# Altium schematic sheet sfp_phy_0.SchDoc: <SPECIFIC SHEET FUNCTION>
size A3; Date: DO NOT USE, RATHER USE PROJ OPTIONS; DrawnBy: DO NOT USE, RATHER USE PROJ OPTIONS; Engineer: DO NOT USE, RATHER USE PROJ OPTIONS; Organization: DO NOT USE, RATHER USE PROJ OPTIONS; DocumentNumber: DO NOT USE, RATHER USE PROJ OPTIONS; Revision: DO NOT USE, RATHER USE PROJ OPTIONS; SheetNumber: 1; SheetTotal: 1; SCH_Sheet_Filename: <Filename.SchDoc>; CurrentTime: DO NOT USE, RATHER USE PROJ OPTIONS; Time: DO NOT USE, RATHER USE PROJ OPTIONS; DocumentFullPathAndName: DO NOT USE, RATHER USE PROJ OPTIONS; DocumentName: DO NOT USE, RATHER USE PROJ OPTIONS; ModifiedDate: DO NOT USE, RATHER USE PROJ OPTIONS; ImagePath: DO NOT USE, RATHER USE PROJ OPTIONS
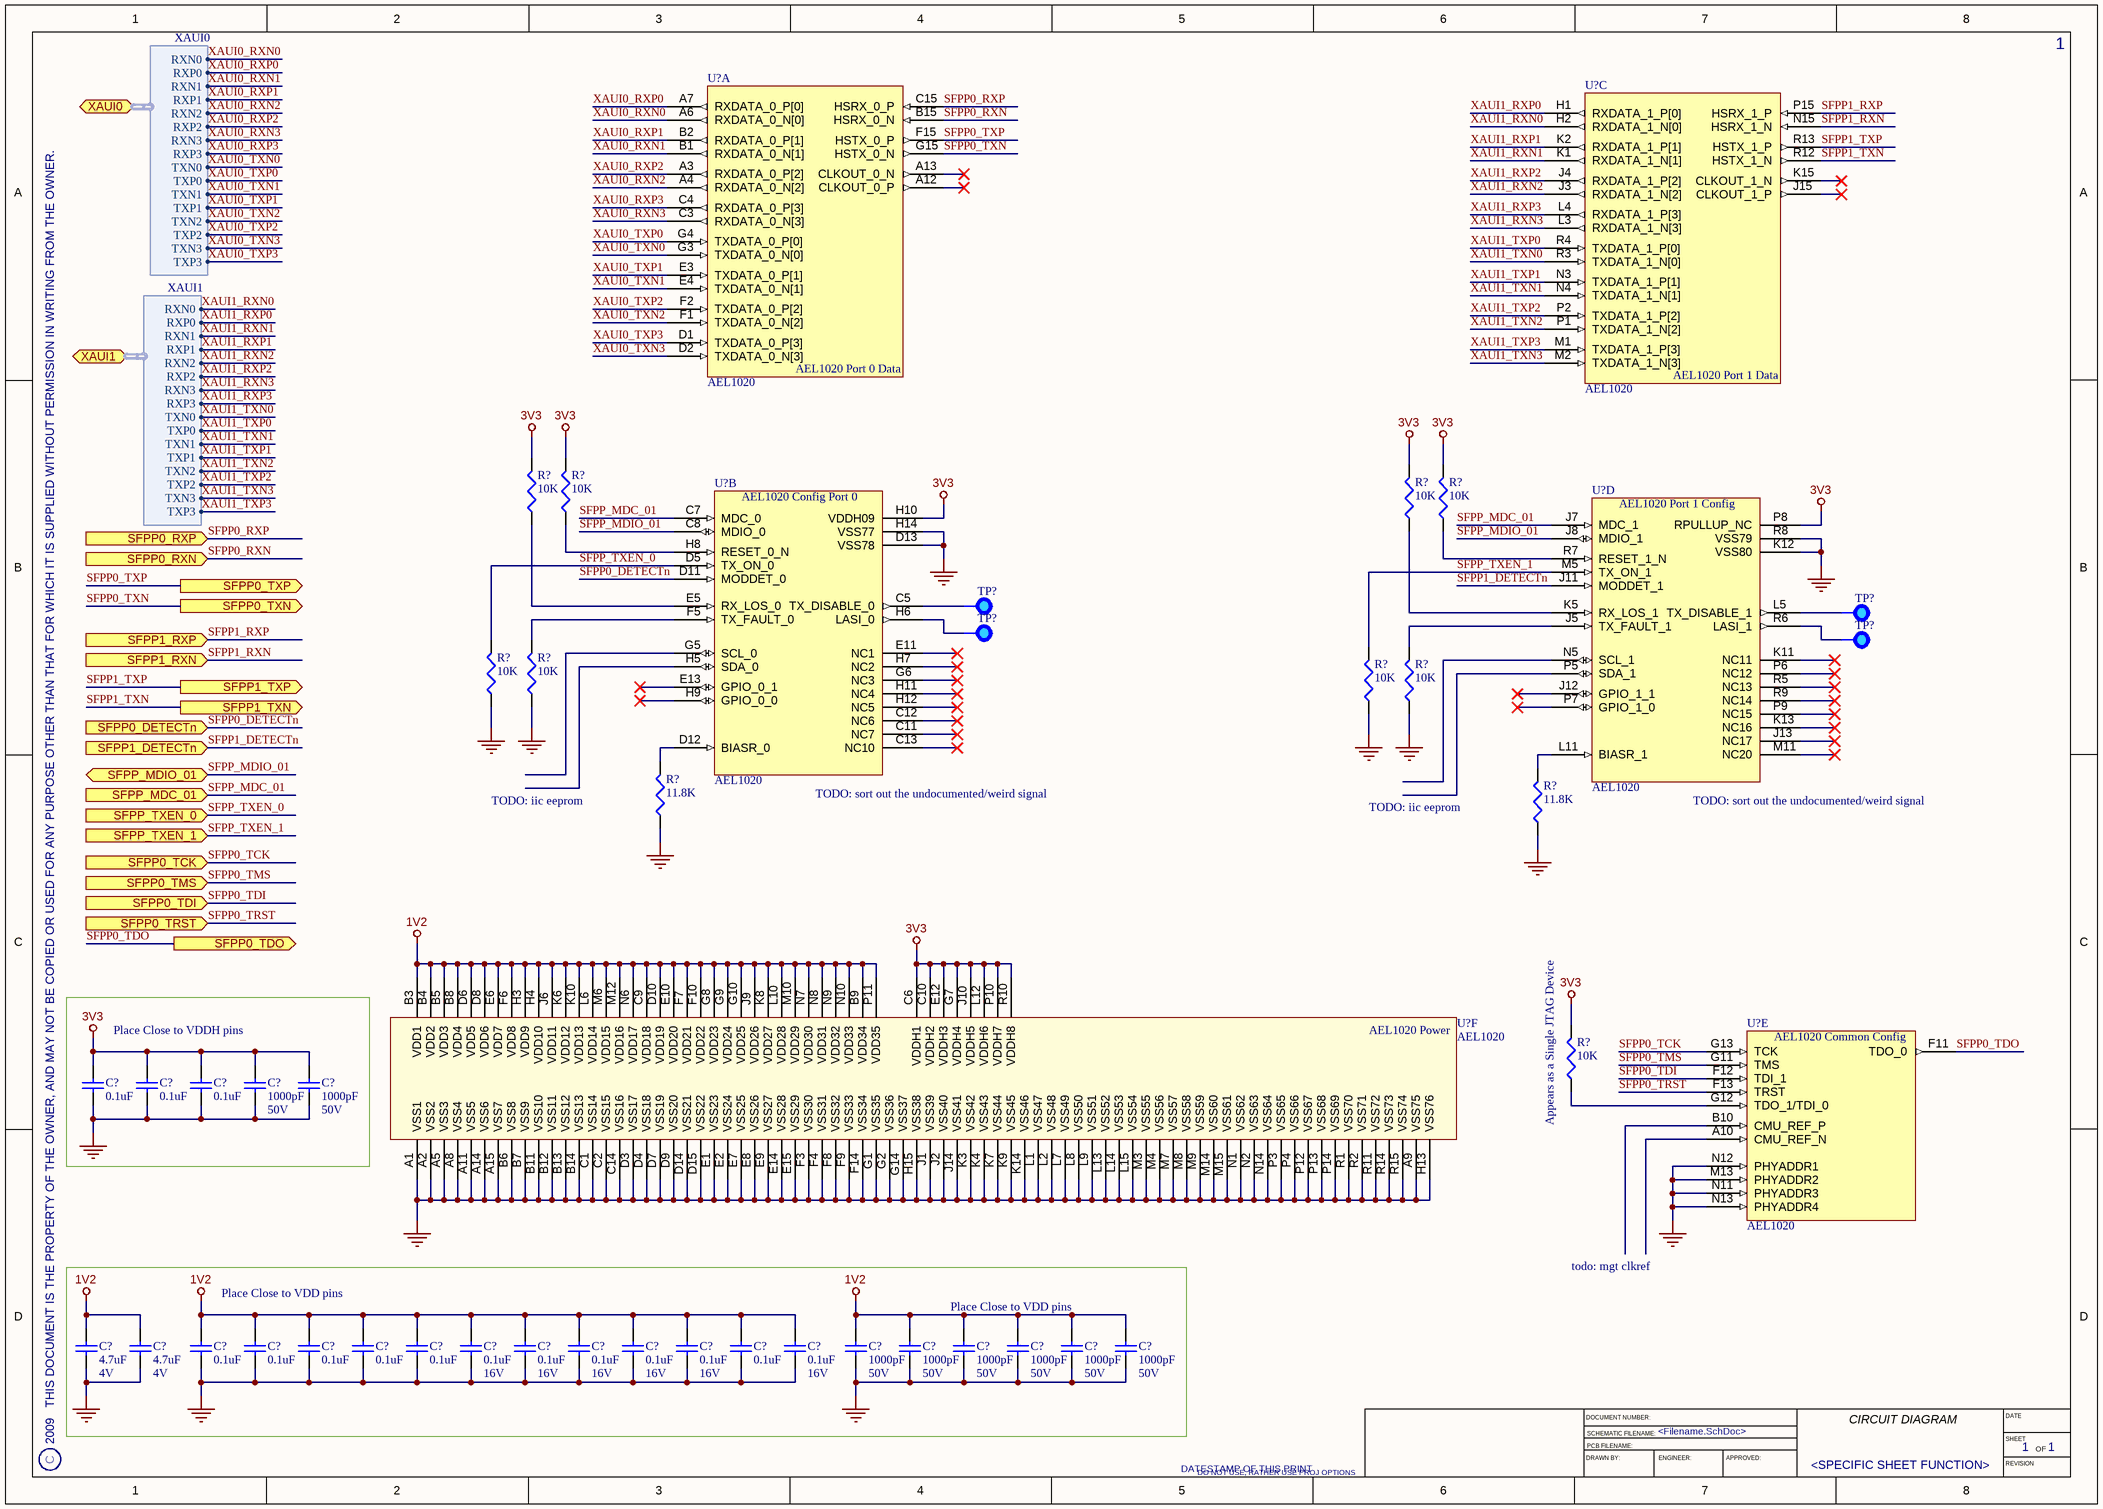
[diagram p0: sfp_phy_0.SchDoc]

## Parts
(Parts that share a designator on the sheet are numbered #1, #2 ... from top to bottom, then left to right.)
C?#1  value 0.1uF  [CAPC1005L]  (hidden comment: CapStd)
C?#2  value 0.1uF  [CAPC1005L]  (hidden comment: CapStd)
C?#3  value 0.1uF  [CAPC1005L]  (hidden comment: CapStd)
C?#4  value 1000pF  Rating: 50V  [CAPC1005L]  (hidden comment: CapStd)
C?#5  value 1000pF  Rating: 50V  [CAPC1005L]  (hidden comment: CapStd)
C?#6  value 4.7uF  Rating: 4V  [CAPC1005L]  (hidden comment: CapStd)
C?#7  value 4.7uF  Rating: 4V  [CAPC1005L]  (hidden comment: CapStd)
C?#8  value 0.1uF  [CAPC1005L]  (hidden comment: CapStd)
C?#9  value 0.1uF  [CAPC1005L]  (hidden comment: CapStd)
C?#10  value 0.1uF  [CAPC1005L]  (hidden comment: CapStd)
C?#11  value 0.1uF  [CAPC1005L]  (hidden comment: CapStd)
C?#12  value 0.1uF  [CAPC1005L]  (hidden comment: CapStd)
C?#13  value 0.1uF  Rating: 16V  [CAPC1005L]  (hidden comment: CapStd)
C?#14  value 0.1uF  Rating: 16V  [CAPC1005L]  (hidden comment: CapStd)
C?#15  value 0.1uF  Rating: 16V  [CAPC1005L]  (hidden comment: CapStd)
C?#16  value 0.1uF  Rating: 16V  [CAPC1005L]  (hidden comment: CapStd)
C?#17  value 0.1uF  Rating: 16V  [CAPC1005L]  (hidden comment: CapStd)
C?#18  value 0.1uF  [CAPC1005L]  (hidden comment: CapStd)
C?#19  value 0.1uF  Rating: 16V  [CAPC1005L]  (hidden comment: CapStd)
C?#20  value 1000pF  Rating: 50V  [CAPC1005L]  (hidden comment: CapStd)
C?#21  value 1000pF  Rating: 50V  [CAPC1005L]  (hidden comment: CapStd)
C?#22  value 1000pF  Rating: 50V  [CAPC1005L]  (hidden comment: CapStd)
C?#23  value 1000pF  Rating: 50V  [CAPC1005L]  (hidden comment: CapStd)
C?#24  value 1000pF  Rating: 50V  [CAPC1005L]  (hidden comment: CapStd)
C?#25  value 1000pF  Rating: 50V  [CAPC1005L]  (hidden comment: CapStd)
R?#1  value 10K  [RESC1005L]  (hidden comment: ResStd)
R?#2  value 10K  [RESC1005L]  (hidden comment: ResStd)
R?#3  value 10K  [RESC1005L]  (hidden comment: ResStd)
R?#4  value 10K  [RESC1005L]  (hidden comment: ResStd)
R?#5  value 10K  [RESC1005L]  (hidden comment: ResStd)
R?#6  value 10K  [RESC1005L]  (hidden comment: ResStd)
R?#7  value 10K  [RESC1005L]  (hidden comment: ResStd)
R?#8  value 10K  [RESC1005L]  (hidden comment: ResStd)
R?#9  value 11.8K  [RESC1608L]  (hidden comment: ResStd)
R?#10  value 11.8K  [RESC1608L]  (hidden comment: ResStd)
R?#11  value 10K  [RESC1005L]  (hidden comment: ResStd)
TP?#1  Testpoint  [TP-TBD]  (value not drawn)
TP?#2  Testpoint  [TP-TBD]  (value not drawn)
TP?#3  Testpoint  [TP-TBD]  (value not drawn)
TP?#4  Testpoint  [TP-TBD]  (value not drawn)
U?#1  AEL1020  [AEL1020]  (part A of 6)
U?#2  AEL1020  [AEL1020]  (part C of 6)
U?#3  AEL1020  [AEL1020]  (part B of 6)
U?#4  AEL1020  [AEL1020]  (part D of 6)
U?#5  AEL1020  [AEL1020]  (part F of 6)
U?#6  AEL1020  [AEL1020]  (part E of 6)

## Blocks framed on the sheet
Place Close to VDDH pins: C?#1-C?#5

## Ports
SFPP0_DETECTn (in), SFPP0_RXN (in), SFPP0_RXP (in), SFPP0_TCK (in), SFPP0_TDI (in), SFPP0_TDO (out), SFPP0_TMS (in), SFPP0_TRST (in), SFPP0_TXN (out), SFPP0_TXP (out), SFPP1_DETECTn (in), SFPP1_RXN (in), SFPP1_RXP (in), SFPP1_TXN (out), SFPP1_TXP (out), SFPP_MDC_01 (in), SFPP_MDIO_01 (bidir), SFPP_TXEN_0 (in), SFPP_TXEN_1 (in), XAUI0 (harness XAUI0), XAUI1 (harness XAUI1)

## Harnesses
XAUI0: RXN0, RXP0, RXN1, RXP1, RXN2, RXP2, RXN3, RXP3, TXN0, TXP0, TXN1, TXP1, TXN2, TXP2, TXN3, TXP3
XAUI1: RXN0, RXP0, RXN1, RXP1, RXN2, RXP2, RXN3, RXP3, TXN0, TXP0, TXN1, TXP1, TXN2, TXP2, TXN3, TXP3

## Nets
1V2: C?#6.2 C?#7.2 C?#8.2 C?#9.2 C?#10.2 C?#11.2 C?#12.2 C?#13.2 C?#14.2 C?#15.2 C?#16.2 C?#17.2 C?#18.2 C?#19.2 C?#20.2 C?#21.2 C?#22.2 C?#23.2 C?#24.2 C?#25.2 U?#5.B3(VDD1) U?#5.B4(VDD2) U?#5.B5(VDD3) U?#5.B8(VDD4) U?#5.B9(VDD34) U?#5.C9(VDD18) U?#5.D6(VDD5) U?#5.D8(VDD6) U?#5.D10(VDD19) U?#5.E6(VDD7) U?#5.E10(VDD20) U?#5.F6(VDD8) U?#5.F7(VDD21) U?#5.F10(VDD22) U?#5.G8(VDD23) U?#5.G9(VDD24) U?#5.G10(VDD25) U?#5.H3(VDD9) U?#5.H4(VDD10) U?#5.J6(VDD11) U?#5.J9(VDD26) U?#5.K6(VDD12) U?#5.K8(VDD27) U?#5.K10(VDD13) U?#5.L6(VDD14) U?#5.L10(VDD28) U?#5.M6(VDD15) U?#5.M10(VDD29) U?#5.M12(VDD16) U?#5.N6(VDD17) U?#5.N7(VDD30) U?#5.N8(VDD31) U?#5.N9(VDD32) U?#5.N10(VDD33) U?#5.P11(VDD35)
3V3: C?#1.2 C?#2.2 C?#3.2 C?#4.2 C?#5.2 R?#1.2 R?#2.2 R?#3.2 R?#4.2 R?#11.2 U?#3.H10(VDDH09) U?#4.P8(RPULLUP_NC) U?#5.C6(VDDH1) U?#5.C10(VDDH2) U?#5.E12(VDDH3) U?#5.G7(VDDH4) U?#5.J10(VDDH5) U?#5.L12(VDDH6) U?#5.P10(VDDH7) U?#5.R10(VDDH8)
GND: C?#1.1 C?#2.1 C?#3.1 C?#4.1 C?#5.1 C?#6.1 C?#7.1 C?#8.1 C?#9.1 C?#10.1 C?#11.1 C?#12.1 C?#13.1 C?#14.1 C?#15.1 C?#16.1 C?#17.1 C?#18.1 C?#19.1 C?#20.1 C?#21.1 C?#22.1 C?#23.1 C?#24.1 C?#25.1 R?#5.1 R?#6.1 R?#7.1 R?#8.1 R?#9.1 R?#10.1 U?#3.D13(VSS78) U?#3.H14(VSS77) U?#4.K12(VSS80) U?#4.R8(VSS79) U?#5.A1(VSS1) U?#5.A2(VSS2) U?#5.A5(VSS3) U?#5.A8(VSS4) U?#5.A9(VSS75) U?#5.A11(VSS5) U?#5.A14(VSS6) U?#5.A15(VSS7) U?#5.B6(VSS8) U?#5.B7(VSS9) U?#5.B11(VSS10) U?#5.B12(VSS11) U?#5.B13(VSS12) U?#5.B14(VSS13) U?#5.C1(VSS14) U?#5.C2(VSS15) U?#5.C14(VSS16) U?#5.D3(VSS17) U?#5.D4(VSS18) U?#5.D7(VSS19) U?#5.D9(VSS20) U?#5.D14(VSS21) U?#5.D15(VSS22) U?#5.E1(VSS23) U?#5.E2(VSS24) U?#5.E7(VSS25) U?#5.E8(VSS26) U?#5.E9(VSS27) U?#5.E14(VSS28) U?#5.E15(VSS29) U?#5.F3(VSS30) U?#5.F4(VSS31) U?#5.F8(VSS32) U?#5.F9(VSS33) U?#5.F14(VSS34) U?#5.G1(VSS35) U?#5.G2(VSS36) U?#5.G14(VSS37) U?#5.H13(VSS76) U?#5.H15(VSS38) U?#5.J1(VSS39) U?#5.J2(VSS40) U?#5.J14(VSS41) U?#5.K3(VSS42) U?#5.K4(VSS43) U?#5.K7(VSS44) U?#5.K9(VSS45) U?#5.K14(VSS46) U?#5.L1(VSS47) U?#5.L2(VSS48) U?#5.L7(VSS49) U?#5.L8(VSS50) U?#5.L9(VSS51) U?#5.L13(VSS52) U?#5.L14(VSS53) U?#5.L15(VSS54) U?#5.M3(VSS55) U?#5.M4(VSS56) U?#5.M7(VSS57) U?#5.M8(VSS58) U?#5.M9(VSS59) U?#5.M14(VSS60) U?#5.M15(VSS61) U?#5.N1(VSS62) U?#5.N2(VSS63) U?#5.N14(VSS64) U?#5.P3(VSS65) U?#5.P4(VSS66) U?#5.P12(VSS67) U?#5.P13(VSS68) U?#5.P14(VSS69) U?#5.R1(VSS70) U?#5.R2(VSS71) U?#5.R11(VSS72) U?#5.R14(VSS73) U?#5.R15(VSS74) U?#6.M13(PHYADDR2) U?#6.N11(PHYADDR3) U?#6.N12(PHYADDR1) U?#6.N13(PHYADDR4)
SFPP0_DETECTn: U?#3.D11(MODDET_0) ; port SFPP0_DETECTn
SFPP0_RXN: U?#1.B15(HSRX_0_N) ; port SFPP0_RXN
SFPP0_RXP: U?#1.C15(HSRX_0_P) ; port SFPP0_RXP
SFPP0_TCK: U?#6.G13(TCK) ; port SFPP0_TCK
SFPP0_TDI: U?#6.F12(TDI_1) ; port SFPP0_TDI
SFPP0_TDO: U?#6.F11(TDO_0) ; port SFPP0_TDO
SFPP0_TMS: U?#6.G11(TMS) ; port SFPP0_TMS
SFPP0_TRST: U?#6.F13(TRST) ; port SFPP0_TRST
SFPP0_TXN: U?#1.G15(HSTX_0_N) ; port SFPP0_TXN
SFPP0_TXP: U?#1.F15(HSTX_0_P) ; port SFPP0_TXP
SFPP1_DETECTn: U?#4.J11(MODDET_1) ; port SFPP1_DETECTn
SFPP1_RXN: U?#2.N15(HSRX_1_N) ; port SFPP1_RXN
SFPP1_RXP: U?#2.P15(HSRX_1_P) ; port SFPP1_RXP
SFPP1_TXN: U?#2.R12(HSTX_1_N) ; port SFPP1_TXN
SFPP1_TXP: U?#2.R13(HSTX_1_P) ; port SFPP1_TXP
SFPP_MDC_01: U?#3.C7(MDC_0) U?#4.J7(MDC_1) ; port SFPP_MDC_01
SFPP_MDIO_01: U?#3.C8(MDIO_0) U?#4.J8(MDIO_1) ; port SFPP_MDIO_01
SFPP_TXEN_0: R?#5.2 U?#3.D5(TX_ON_0) ; port SFPP_TXEN_0
SFPP_TXEN_1: R?#7.2 U?#4.M5(TX_ON_1) ; port SFPP_TXEN_1
XAUI0_RXN0: U?#1.A6(RXDATA_0_N[0]) ; port XAUI0.RXN0
XAUI0_RXN1: U?#1.B1(RXDATA_0_N[1]) ; port XAUI0.RXN1
XAUI0_RXN2: U?#1.A4(RXDATA_0_N[2]) ; port XAUI0.RXN2
XAUI0_RXN3: U?#1.C3(RXDATA_0_N[3]) ; port XAUI0.RXN3
XAUI0_RXP0: U?#1.A7(RXDATA_0_P[0]) ; port XAUI0.RXP0
XAUI0_RXP1: U?#1.B2(RXDATA_0_P[1]) ; port XAUI0.RXP1
XAUI0_RXP2: U?#1.A3(RXDATA_0_P[2]) ; port XAUI0.RXP2
XAUI0_RXP3: U?#1.C4(RXDATA_0_P[3]) ; port XAUI0.RXP3
XAUI0_TXN0: U?#1.G3(TXDATA_0_N[0]) ; port XAUI0.TXN0
XAUI0_TXN1: U?#1.E4(TXDATA_0_N[1]) ; port XAUI0.TXN1
XAUI0_TXN2: U?#1.F1(TXDATA_0_N[2]) ; port XAUI0.TXN2
XAUI0_TXN3: U?#1.D2(TXDATA_0_N[3]) ; port XAUI0.TXN3
XAUI0_TXP0: U?#1.G4(TXDATA_0_P[0]) ; port XAUI0.TXP0
XAUI0_TXP1: U?#1.E3(TXDATA_0_P[1]) ; port XAUI0.TXP1
XAUI0_TXP2: U?#1.F2(TXDATA_0_P[2]) ; port XAUI0.TXP2
XAUI0_TXP3: U?#1.D1(TXDATA_0_P[3]) ; port XAUI0.TXP3
XAUI1_RXN0: U?#2.H2(RXDATA_1_N[0]) ; port XAUI1.RXN0
XAUI1_RXN1: U?#2.K1(RXDATA_1_N[1]) ; port XAUI1.RXN1
XAUI1_RXN2: U?#2.J3(RXDATA_1_N[2]) ; port XAUI1.RXN2
XAUI1_RXN3: U?#2.L3(RXDATA_1_N[3]) ; port XAUI1.RXN3
XAUI1_RXP0: U?#2.H1(RXDATA_1_P[0]) ; port XAUI1.RXP0
XAUI1_RXP1: U?#2.K2(RXDATA_1_P[1]) ; port XAUI1.RXP1
XAUI1_RXP2: U?#2.J4(RXDATA_1_P[2]) ; port XAUI1.RXP2
XAUI1_RXP3: U?#2.L4(RXDATA_1_P[3]) ; port XAUI1.RXP3
XAUI1_TXN0: U?#2.R3(TXDATA_1_N[0]) ; port XAUI1.TXN0
XAUI1_TXN1: U?#2.N4(TXDATA_1_N[1]) ; port XAUI1.TXN1
XAUI1_TXN2: U?#2.P1(TXDATA_1_N[2]) ; port XAUI1.TXN2
XAUI1_TXN3: U?#2.M2(TXDATA_1_N[3]) ; port XAUI1.TXN3
XAUI1_TXP0: U?#2.R4(TXDATA_1_P[0]) ; port XAUI1.TXP0
XAUI1_TXP1: U?#2.N3(TXDATA_1_P[1]) ; port XAUI1.TXP1
XAUI1_TXP2: U?#2.P2(TXDATA_1_P[2]) ; port XAUI1.TXP2
XAUI1_TXP3: U?#2.M1(TXDATA_1_P[3]) ; port XAUI1.TXP3
NetR?#1_1: R?#1.1 U?#3.E5(RX_LOS_0)
NetR?#2_1: R?#2.1 U?#3.H8(RESET_0_N)
NetR?#3_1: R?#3.1 U?#4.K5(RX_LOS_1)
NetR?#4_1: R?#4.1 U?#4.R7(RESET_1_N)
NetR?#6_2: R?#6.2 U?#3.F5(TX_FAULT_0)
NetR?#8_2: R?#8.2 U?#4.J5(TX_FAULT_1)
NetR?#9_2: R?#9.2 U?#3.D12(BIASR_0)
NetR?#10_2: R?#10.2 U?#4.L11(BIASR_1)
NetR?#11_1: R?#11.1 U?#6.G12(TDO_1/TDI_0)
NetTP?#1_1: TP?#1.1 U?#3.C5(TX_DISABLE_0)
NetTP?#2_1: TP?#2.1 U?#4.L5(TX_DISABLE_1)
NetTP?#3_1: TP?#3.1 U?#3.H6(LASI_0)
NetTP?#4_1: TP?#4.1 U?#4.R6(LASI_1)

Not connected (* = marked no-connect by the designer): U?#1 A12(CLKOUT_0_P)* A13(CLKOUT_0_N)*; U?#2 J15(CLKOUT_1_P)* K15(CLKOUT_1_N)*; U?#3 C11(NC7)* C12(NC6)* C13(NC10)* E11(NC1)* E13(GPIO_0_1)* G5(SCL_0) G6(NC3)* H5(SDA_0) H7(NC2)* H9(GPIO_0_0)* H11(NC4)* H12(NC5)*; U?#4 J12(GPIO_1_1)* J13(NC17)* K11(NC11)* K13(NC16)* M11(NC20)* N5(SCL_1) P5(SDA_1) P6(NC12)* P7(GPIO_1_0)* P9(NC15)* R5(NC13)* R9(NC14)*; U?#6 A10(CMU_REF_N) B10(CMU_REF_P)

## Notes on the sheet
- TODO: iic eeprom
- (near U?#3) TODO: sort out the undocumented/weird signal
- (near U?#4) TODO: sort out the undocumented/weird signal
- (near R?#11) Appears as a Single JTAG Device
- (near C?#10) Place Close to VDD pins
- (near C?#22) Place Close to VDD pins
- todo: mgt clkref
- 2009   THIS DOCUMENT IS THE PROPERTY OF THE OWNER, AND MAY NOT BE COPIED OR USED FOR ANY PURPOSE OTHER THAN THAT FOR WHICH IT IS SUPPLIED WITHOUT PERMISSION IN WRITING FROM THE OWNER.
- C
- DATESTAMP OF THIS PRINT
- DRAWN BY:
- DOCUMENT NUMBER:
- SCHEMATIC FILENAME:
- PCB FILENAME:
- ENGINEER:
- APPROVED:
- CIRCUIT DIAGRAM
- DATE
- SHEET
- REVISION
- OF
- (in symbol AEL1020, part A) AEL1020 Port 0 Data
- (in symbol AEL1020, part B) AEL1020 Config Port 0
- (in symbol AEL1020, part C) AEL1020 Port 1 Data
- (in symbol AEL1020, part D) AEL1020 Port 1 Config
- (in symbol AEL1020, part E) AEL1020 Common Config
- (in symbol AEL1020, part F) AEL1020 Power

## Library data of the parts
C?#1-C?#3 C?#8-C?#19 = CapStd: Capacitor; Manufacturer: VENKEL; Part: C0402X7R160-104KN
C?#4 C?#5 C?#20-C?#25 = CapStd: Capacitor; Manufacturer: Murata; Part: GRM155R61A102KA01B; Tolerance: 15%
C?#6 C?#7 = CapStd: Capacitor; Manufacturer: TAIYO YUDEN; Part: AMK105BJ475MV-F; Tolerance: 20%
R?#1-R?#8 R?#11 = ResStd: Resistor; Part: 0402WGJ103T1E; Manufacturer: ROYALOHM; Tolerance: 5%; Rating: 0.0625W
R?#9 R?#10 = ResStd: Resistor; Part: 0402WGF1192T1E; Manufacturer: ROYALOHM; Tolerance: 1%; Rating: 0.0625W
TP?#1-TP?#4 = Testpoint: Standard testpoint
U?#1-U?#6 = AEL1020: Ten GBPS XFP & SFP+ Dual Port Transceiver; Manufacturer: NetLogic; Part: AEL1020